# Altium schematic sheet CaINv2.2.SchDoc
size A4; SheetNumber: 2; SheetTotal: 2
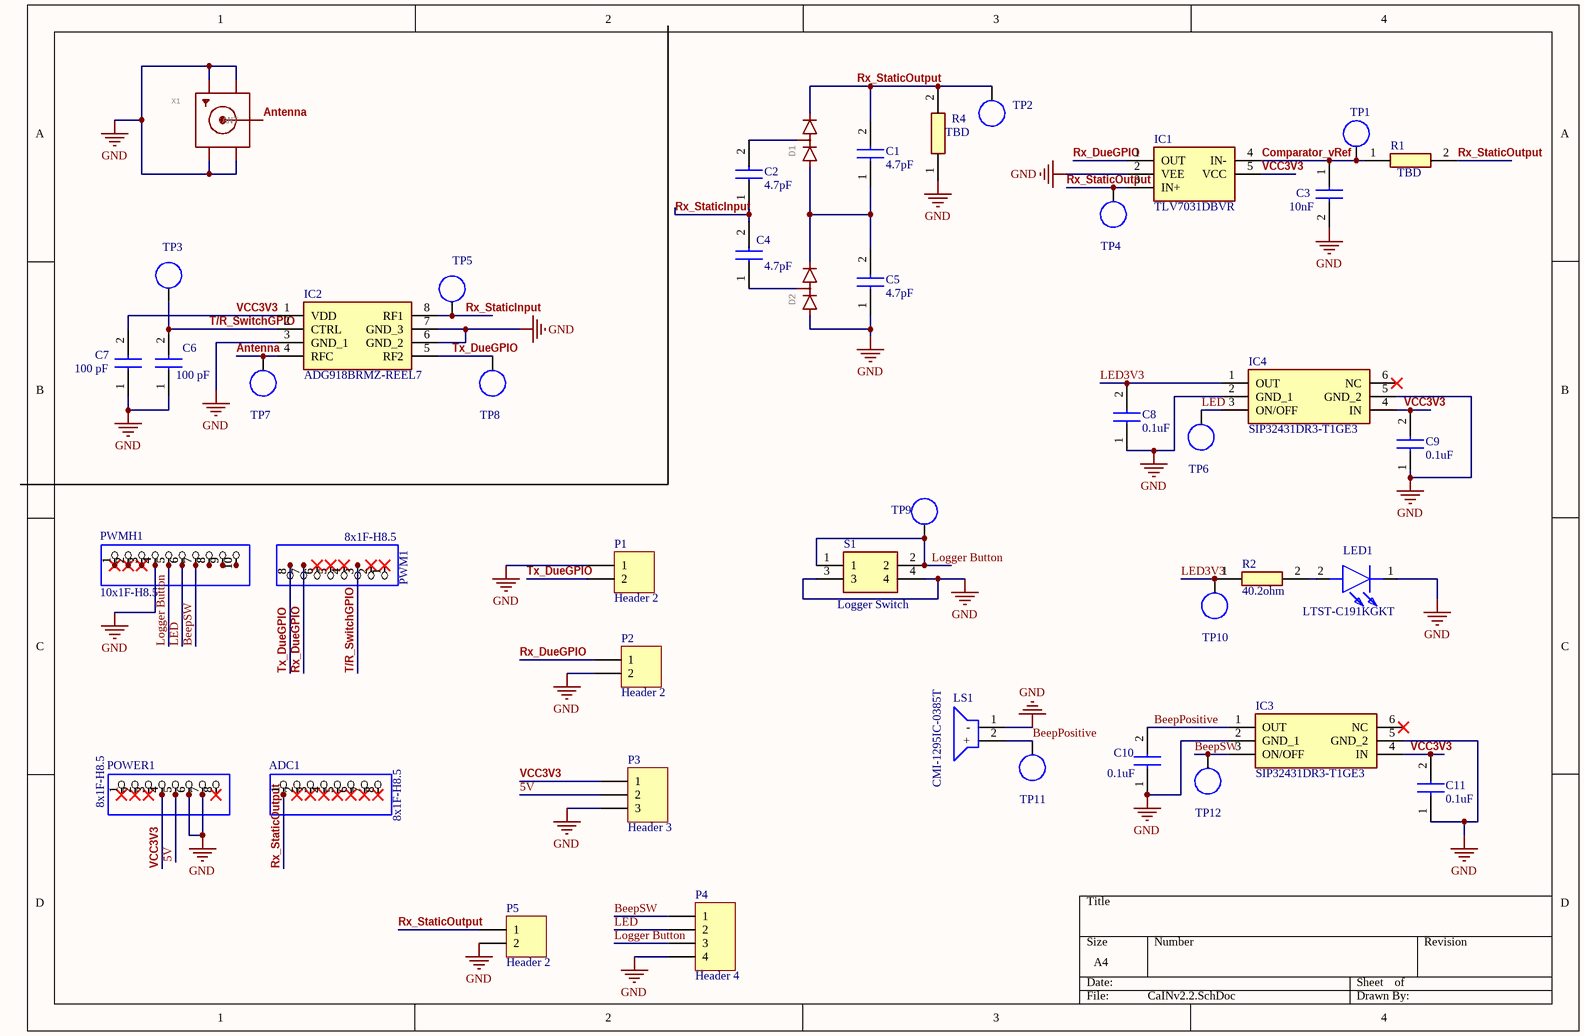
[diagram p0: CaINv2.2.SchDoc]

## Parts
ADC1  8x1F-H8.5  [1X08]
C1  4.7pF  [CAPC2012X145N]
C2  4.7pF  [CAPC2012X145N]
C3  10nF  [CAPC2012X145N]
C4  4.7pF  [CAPC2012X145N]
C5  4.7pF  [CAPC2012X145N]
C6  100 pF  [CAPC2012X145N]
C7  100 pF  [CAPC2012X145N]
C8  0.1uF  [CAPC2012X145N]
C9  0.1uF  [CAPC2012X145N]
C10  0.1uF  [CAPC2012X145N]
C11  0.1uF  [CAPC2012X145N]
D1  RB706F-40FHT106  [SOT23]  (value not drawn)
D2  RB706F-40FHT106  [SOT23]  (value not drawn)
IC1  TLV7031DBVR  [SOT95P280X145-5N]
IC2  ADG918BRMZ-REEL7  [SOP65P490X110-8N]
IC3  SIP32431DR3-T1GE3  [SOT65P210X110-6N]
IC4  SIP32431DR3-T1GE3  [SOT65P210X110-6N]
LED1  LTST-C191KGKT  [LEDC1608X55N]
LS1  CMI-1295IC-0385T  [CMI1295IC0385T]
P1  Header 2  [HDR1X2]
P2  Header 2  [HDR1X2]
P3  Header 3  [HDR1X3]
P4  Header 4  [HDR1X4]
P5  Header 2  [HDR1X2]
POWER1  8x1F-H8.5  [1X08]
PWM1  8x1F-H8.5  [1X08]
PWMH1  10x1F-H8.5  [1X10]
R1  TBD  [RESC2012X50N]
R2  40.2ohm  [RESC1608X55N]
R4  TBD  [RESC2012X50N]
S1  Logger Switch  [PTS645(SMT)]
TP1  TP  [TestPoint]  (value not drawn)  (no BOM)
TP2  TP  [TestPoint]  (value not drawn)  (no BOM)
TP3  TP  [TestPoint]  (value not drawn)  (no BOM)
TP4  TP  [TestPoint]  (value not drawn)  (no BOM)
TP5  TP  [TestPoint]  (value not drawn)  (no BOM)
TP6  TP  [TestPoint]  (value not drawn)  (no BOM)
TP7  TP  [TestPoint]  (value not drawn)  (no BOM)
TP8  TP  [TestPoint]  (value not drawn)  (no BOM)
TP9  TP  [TestPoint]  (value not drawn)  (no BOM)
TP10  TP  [TestPoint]  (value not drawn)  (no BOM)
TP11  TP  [TestPoint]  (value not drawn)  (no BOM)
TP12  TP  [TestPoint]  (value not drawn)  (no BOM)
X1  SMACONNECTOR_EDGE  [SMA_EDGELAUNCH]  (value not drawn)

## Nets
GND: C3.2 C5.1 C6.1 C7.1 C8.1 C9.1 C10.1 C11.1 D2.1(A) IC1.2(VEE) IC2.3(GND_1) IC2.6(GND_2) IC2.7(GND_3) IC3.2(GND_1) IC3.5(GND_2) IC4.2(GND_1) IC4.5(GND_2) LED1.1(K) LS1.1(-) P1.1 P2.2 P3.3 P4.4 P5.2 POWER1.6 POWER1.7 PWMH1.4 R4.1 S1.3 S1.4 X1.GND@1(GND4) X1.GND@2(GND3) X1.GND@3(GND2) X1.GND@4(GND1)
5V: P3.2 POWER1.5
Antenna: IC2.4(RFC) TP7.TP X1.P(ANT)
BeepPositive: C10.2 IC3.1(OUT) LS1.2(+) TP11.TP
BeepSW: IC3.3(ON/OFF) P4.1 PWMH1.7 TP12.TP
Comparator_vRef: C3.1 IC1.4(IN-) R1.1 TP1.TP
LED: IC4.3(ON/OFF) P4.2 PWMH1.6 TP6.TP
LED3V3: C8.2 IC4.1(OUT) R2.1 TP10.TP
Logger Button: P4.3 PWMH1.5 S1.1 S1.2 TP9.TP
Rx_DueGPIO: IC1.1(OUT) P2.1 PWM1.7
Rx_StaticInput: C2.1 C4.2 IC2.8(RF1) TP5.TP
Rx_StaticOutput: ADC1.1 C1.2 D1.2(C) IC1.3(IN+) P5.1 R1.2 R4.2 TP2.TP TP4.TP
T/R_SwitchGPIO: C6.2 IC2.2(CTRL) PWM1.3 TP3.TP
Tx_DueGPIO: IC2.5(RF2) P1.2 PWM1.8 TP8.TP
VCC3V3: C7.2 C9.2 C11.2 IC1.5(VCC) IC2.1(VDD) IC3.4(IN) IC4.4(IN) P3.1 POWER1.4
NetC1_1: C1.1 C5.2 D1.1(A) D2.2(C)
NetC2_2: C2.2 D1.3(AC)
NetC4_1: C4.1 D2.3(AC)
NetLED1_2: LED1.2(A) R2.2

Not connected (* = marked no-connect by the designer): ADC1 2* 3* 4* 5* 6* 7* 8*; IC3 6(NC)*; IC4 6(NC)*; POWER1 1* 2* 3* 8*; PWM1 1* 2* 4* 5* 6*; PWMH1 1* 2* 3* 8 9 10

## Library data of the parts
ADC1 POWER1 PWM1 = PINHD-1X8
C1 C2 C4-C11 = VJ0805A101JXBMC: Capacitor; Manufacturer_Name: Vishay; Datasheet Link: http://www.vishay.com/docs/45226/vj31xrohsautomlcc.pdf; Height: 1.45mm; Manufacturer_Part_Number: VJ0805A101JXBMC; Mouser Part Number: 77-VJ0805A101JXBMC; Mouser Price/Stock: https://www.mouser.co.uk/ProductDetail/Vishay-Vitramon/VJ0805A101JXBMC?qs=DyYCzLTSlfCgHy2DX6Cz6w%3D%3D; Arrow Part Number: VJ0805A101JXBMC; Arrow Price/Stock: https://www.arrow.com/en/products/vj0805a101jxbmc/vishay?region=nac
C3 = VJ0805Y103KXBAC: Capacitor; Manufacturer_Name: Vishay; Datasheet Link: http://www.vishay.com/docs/45226/vj31xrohsautomlcc.pdf; Height: 1.45mm; Manufacturer_Part_Number: VJ0805Y103KXBAC; Mouser Part Number: 77-VJ08Y100V103K; Mouser Price/Stock: https://www.mouser.co.uk/ProductDetail/Vishay-Vitramon/VJ0805Y103KXBAC?qs=IRuQNBqMOckF0HeddYSaNg%3D%3D; Arrow Part Number: VJ0805Y103KXBAC; Arrow Price/Stock: https://www.arrow.com/en/products/vj0805y103kxbac/vishay?region=nac
D1 D2 = DIODE_2CACA-SOT23: 2 Diodes - Cathode-Anode|Cathode-Anode DIODE_2CACA-SOT23; GateName_1: -B1; SymbolName_1: KA2KA; POPULARITY: 1; DeviceName: SOT23; LibraryName: diode; DeviceSetName: DIODE_2CACA-
IC1 = TLV7031DBVR: Integrated Circuit; Manufacturer_Name: Texas Instruments; Datasheet Link: http://www.ti.com/lit/gpn/TLV7031; Height: 1.45mm; Manufacturer_Part_Number: TLV7031DBVR; Mouser Part Number: 595-TLV7031DBVR; Mouser Price/Stock: https://www.mouser.co.uk/ProductDetail/Texas-Instruments/TLV7031DBVR?qs=EBDBlbfErPzxbC0zg598sw%3D%3D; Arrow Part Number: TLV7031DBVR; Arrow Price/Stock: https://www.arrow.com/en/products/tlv7031dbvr/texas-instruments?region=nac
IC2 = ADG918BRMZ-REEL7: Integrated Circuit; Manufacturer_Name: Analog Devices; Datasheet Link: https://www.analog.com/media/en/technical-documentation/data-sheets/ADG918_919.pdf; Height: 1.1mm; Manufacturer_Part_Number: ADG918BRMZ-REEL7; Mouser Part Number: 584-ADG918BRMZ-R7; Mouser Price/Stock: https://www.mouser.co.uk/ProductDetail/Analog-Devices/ADG918BRMZ-REEL7?qs=BpaRKvA4VqEay0U7Dc17vw%3D%3D; Arrow Part Number: ADG918BRMZ-REEL7; Arrow Price/Stock: https://www.arrow.com/en/products/adg918brmz-reel7/analog-devices
IC3 IC4 = SIP32431DR3-T1GE3: Integrated Circuit; Manufacturer_Name: Vishay; Datasheet Link: https://www.vishay.com/docs/66597/sip32431.pdf; Height: 1.1mm; Manufacturer_Part_Number: SIP32431DR3-T1GE3; Mouser Part Number: 781-SIP32431DR3-GE3; Mouser Price/Stock: https://www.mouser.co.uk/ProductDetail/Vishay-Semiconductors/SIP32431DR3-T1GE3?qs=FfLXECYddQQfTuH6ZEcWCg%3D%3D; Arrow Part Number: SIP32431DR3-T1GE3; Arrow Price/Stock: https://www.arrow.com/en/products/sip32431dr3-t1ge3/vishay?region=nac
LED1 = LTST-C191KGKT: LED; Manufacturer_Name: Lite-On; Datasheet Link: http://www.mouser.com/ds/2/239/S_110_LTST-C191KGKT-369560.pdf; Height: 0.55mm; Manufacturer_Part_Number: LTST-C191KGKT; Mouser Part Number: 859-LTST-C191KGKT; Mouser Price/Stock: https://www.mouser.co.uk/ProductDetail/Lite-On/LTST-C191KGKT?qs=xSPZu9B1aMCRQ5ACasEYAg%3D%3D; Arrow Part Number: LTST-C191KGKT; Arrow Price/Stock: https://www.arrow.com/en/products/ltst-c191kgkt/lite-on-technology?region=nac
LS1 = CMI-1295IC-0385T: Loudspeaker or Buzzer; Manufacturer_Name: CUI Devices; Datasheet Link: https://www.arrow.com/en/products/cmi-1295ic-0385t/cui-devices; Height: 9.7mm; Manufacturer_Part_Number: CMI-1295IC-0385T; Mouser Part Number: 490-CMI-1295IC-0385T; Mouser Price/Stock: https://www.mouser.co.uk/ProductDetail/CUI-Devices/CMI-1295IC-0385T?qs=OlC7AqGiEDk2g42uzfEhlg%3D%3D; Arrow Part Number: CMI-1295IC-0385T; Arrow Price/Stock: https://www.arrow.com/en/products/cmi-1295ic-0385t/cui-devices?region=nac
P1 P2 P5 = Header 2: Header, 2-Pin; LatestRevisionDate: 17-Jul-2002; LatestRevisionNote: Re-released for DXP Platform.; Publisher: Altium Limited
P3 = Header 3: Header, 3-Pin; LatestRevisionDate: 17-Jul-2002; LatestRevisionNote: Re-released for DXP Platform.; Publisher: Altium Limited
P4 = Header 4: Header, 4-Pin; LatestRevisionDate: 17-Jul-2002; LatestRevisionNote: Re-released for DXP Platform.; Publisher: Altium Limited
PWMH1 = PINHD-1X10
R1 R4 = RCS0805100KFKEA: Resistor; Manufacturer_Name: Vishay; Datasheet Link: https://componentsearchengine.com/Datasheets/2/RCS0805100KFKEA.pdf; Height: 0.5mm; Manufacturer_Part_Number: RCS0805100KFKEA; Mouser Part Number: 71-RCS0805100KFKEA; Mouser Price/Stock: https://www.mouser.co.uk/ProductDetail/Vishay-Dale/RCS0805100KFKEA?qs=NKmfXavxMay%252BH0mbX9hKBw%3D%3D; Arrow Part Number: RCS0805100KFKEA; Arrow Price/Stock: https://www.arrow.com/en/products/rcs0805100kfkea/vishay?region=nac
R2 = ERJ-3EKF40R2V: Resistor; Manufacturer_Name: Panasonic; Datasheet Link: http://industrial.panasonic.com/cdbs/www-data/pdf/RDA0000/AOA0000C86.pdf; Height: 0.55mm; Manufacturer_Part_Number: ERJ-3EKF40R2V; Mouser Part Number: 667-ERJ-3EKF40R2V; Mouser Price/Stock: https://www.mouser.co.uk/ProductDetail/Panasonic/ERJ-3EKF40R2V?qs=MVjVSMjNRMp%252B0A6%252BSZkn3A%3D%3D
S1 = PTS645SM43SMTR92LFS: SwitchPTS645SM43SMTR92LFS; Manufacturer_Name: C & K COMPONENTS; Datasheet Link: https://www.ckswitches.com/media/1471/pts645.pdf; Manufacturer_Part_Number: PTS645SM43SMTR92LFS; Mouser Part Number: 611-PTS645SM43SMTR92; Mouser Price/Stock: https://www.mouser.co.uk/ProductDetail/CK/PTS645SM43SMTR92LFS?qs=FESYatJ8odKPktxv6ncfWg%3D%3D; Arrow Part Number: PTS645SM43SMTR92LFS; Arrow Price/Stock: https://www.arrow.com/en/products/pts645sm43smtr92lfs/ck
TP1-TP12 = TestPoint
X1 = SMACONNECTOR_EDGE: SMA Connector   90掳 DIP SMA Connector, 50 Ohm (4UConnector: 07259); GateName_1: G$1; DeviceName: _EDGE; SymbolName_1: SMACONNECTOR; LibraryName: adafruit; DeviceSetName: SMACONNECTOR